# EAGLE design Teensy2ESP8266 (EAGLE 7.5.0)
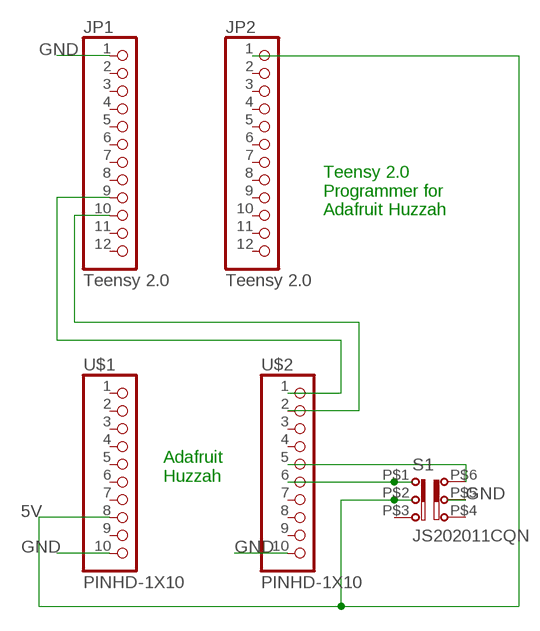
[diagram p0: schematic, sheet 1]

## Parts
JP1  Teensy 2.0  PINHD-1X12  [1X12]
JP2  Teensy 2.0  PINHD-1X12  [1X12]
S1  JS202011CQN  [JS202011CQN]
U$1  PINHD-1X10  [1X10-BIG]
U$2  PINHD-1X10  [1X10-BIG]

## Nets
5V: JP2.1 S1.P$2 U$1.8
GND: JP1.1 S1.P$5 U$1.10 U$2.10
N$1: S1.P$1 U$2.6
N$2: S1.P$6 U$2.5
RX2: JP1.9 U$2.1
TX2: JP1.10 U$2.2
Unconnected: JP1.2 JP1.3 JP1.4 JP1.5 JP1.6 JP1.7 JP1.8 JP1.11 JP1.12 JP2.2 JP2.3 JP2.4 JP2.5 JP2.6 JP2.7 JP2.8 JP2.9 JP2.10 JP2.11 JP2.12 S1.P$3 S1.P$4 U$1.1 U$1.2 U$1.3 U$1.4 U$1.5 U$1.6 U$1.7 U$1.9 U$2.3 U$2.4 U$2.7 U$2.8 U$2.9

## Notes on the sheet
- Teensy 2.0
  Programmer for
  Adafruit Huzzah
- Adafruit
  Huzzah

## Library data of the parts
JP1 JP2 = adafruit:PINHD-1X12: PIN HEADER
S1 = switch-ck:JS202011CQN: DPDT SLIDE SWITCH
U$1 U$2 = adafruit:PINHD-1X10: Pin header 1x10 0.1" spacing With round pins

## Board
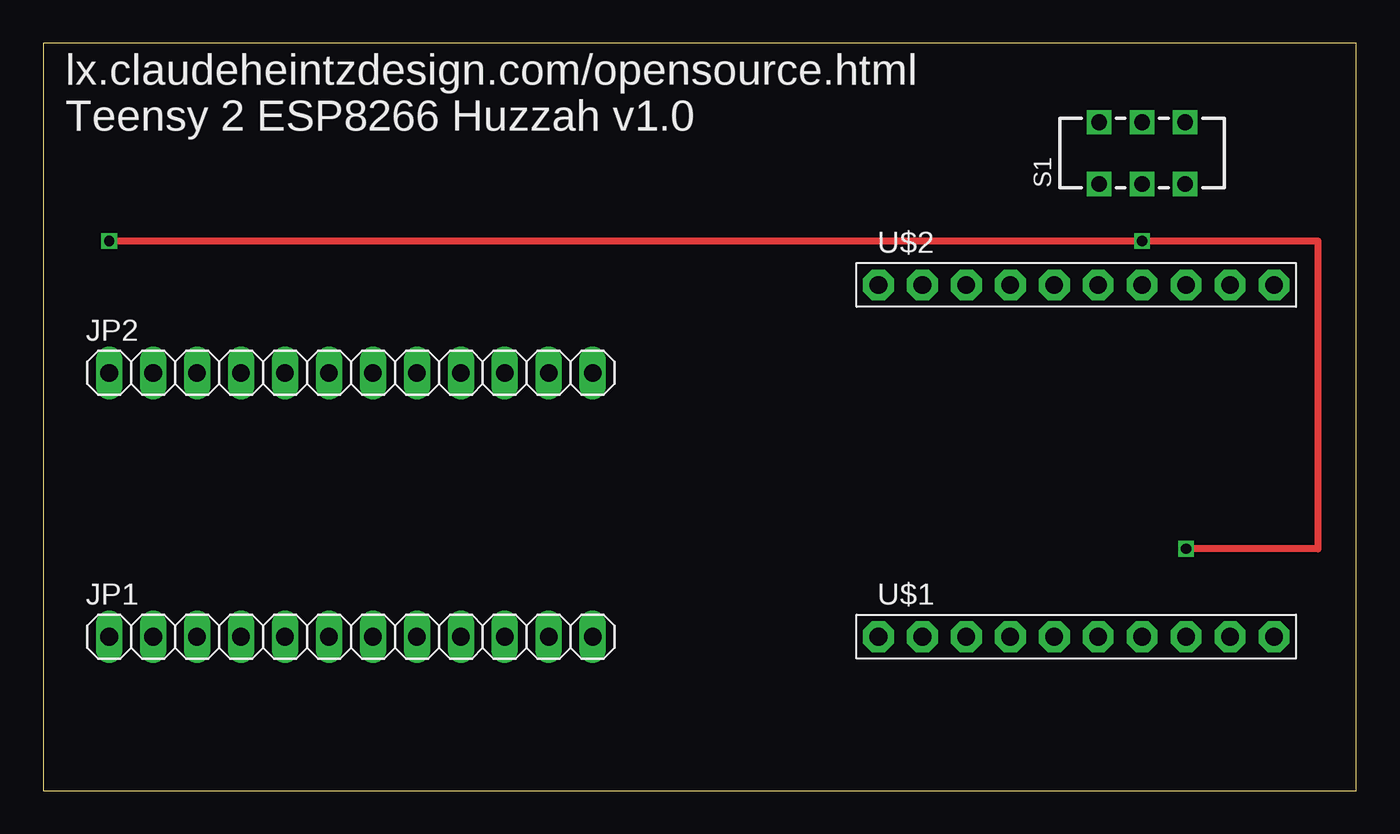
[diagram p1: board, top side]
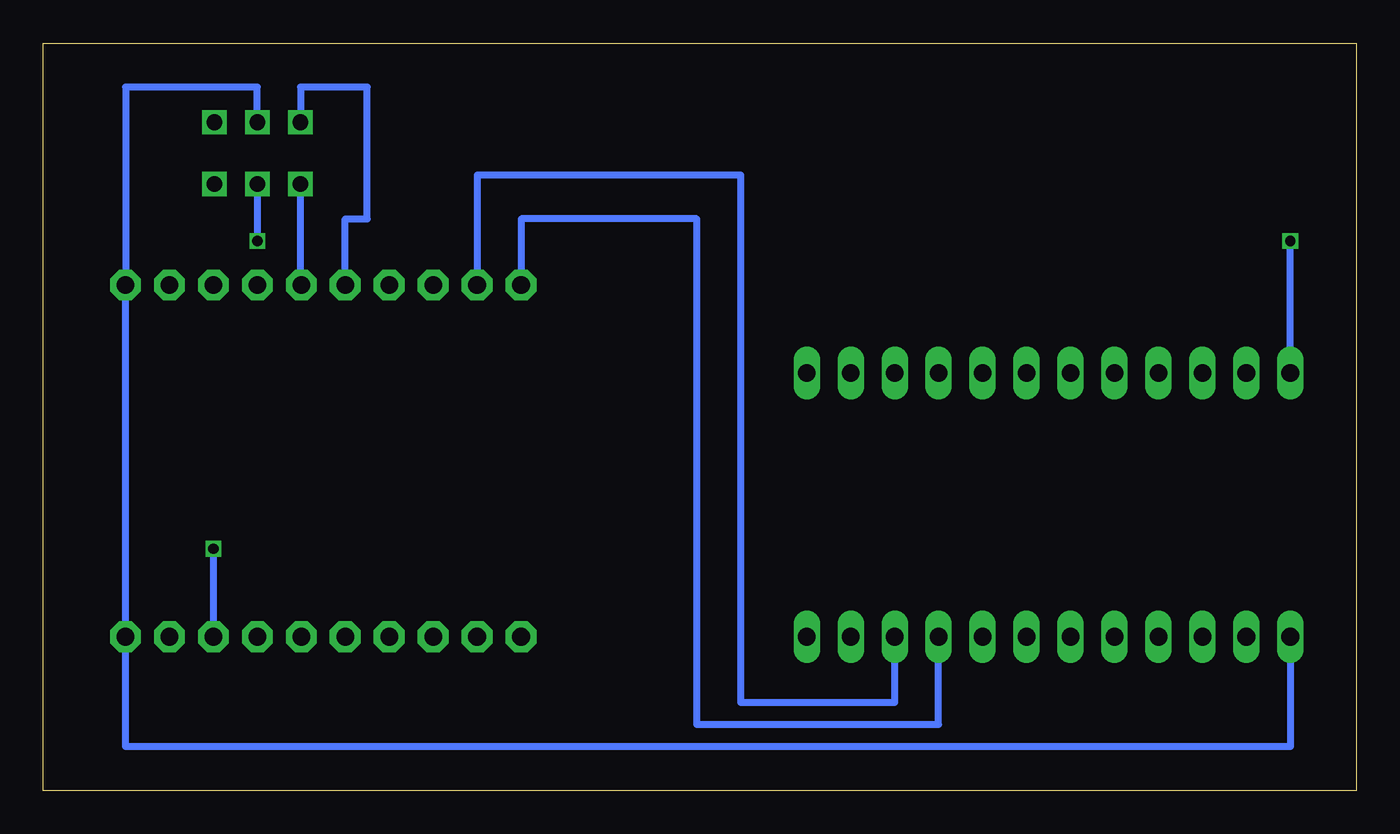
[diagram p2: board, bottom side, seen from below]

Size 75.87 x 43.17 mm. Coordinates in mm from the lower left corner, seen from the top.
Outline: 0,0 75.87,0 75.87,43.17 0,43.17 0,0
Copper layers (1*16): Top 0.035mm / dielectric 1.5mm / Bottom 0.035mm
Design rules "SeeedStudio_2layer_DRU_no_angle_20140221": minimum track width 6mil, minimum drill 12mil, track to track 6mil, track to pad 6mil, pad to pad 6mil, via to via 6mil, smd to smd 0mil, copper to edge 10mil, drill to drill 10mil, minimum pad ring 10mil, minimum via ring 6mil, stop-mask expansion 2mil, vias tented up to drill 100mil, thermal gap 10mil

### Footprints (pad centres in the part's own frame; a part is rotated, then mirrored left to right if it is on the bottom)
1X12 = drill 1.016 long: 1 -13.97,0; 2 -11.43,0; 3 -8.89,0; 4 -6.35,0; 5 -3.81,0; 6 -1.27,0; 7 1.27,0; 8 3.81,0; 9 6.35,0; 10 8.89,0; 11 11.43,0; 12 13.97,0
JS202011CQN = drill 0.9 square: P$1 -2.489,-1.778; P$2 0,-1.778; P$3 2.489,-1.778; P$4 2.489,1.778; P$5 0,1.778; P$6 -2.489,1.778
1X10-BIG = drill 1.016 pad 1.778 octagon: 1 -11.43,0; 2 -8.89,0; 3 -6.35,0; 4 -3.81,0; 5 -1.27,0; 6 1.27,0; 7 3.81,0; 8 6.35,0; 9 8.89,0; 10 11.43,0

### Placement (x,y rotation side)
JP1  17.78,8.89 0 top
JP2  17.78,24.13 0 top
S1  63.5,36.83 0 top
U$1  59.69,8.89 0 top
U$2  59.69,29.21 0 top

### Tracks (layer width: path | path; a pad name or v marks a point on that pad's centre or on a via)
5V  (via drill 0.6)
  Top 0.406: v66.04,13.97 73.66,13.97 73.66,31.75 v63.5,31.75 v3.81,31.75
  Bottom 0.406: S1.P$2 v63.5,31.75 | v66.04,13.97 U$1.8 | JP2.1 v3.81,31.75
GND
  Bottom 0.406: S1.P$5 63.5,40.64 71.12,40.64 U$2.10 U$1.10 71.12,2.54 3.81,2.54 JP1.1
N$1
  Bottom 0.406: U$2.6 61.01,29.21 S1.P$1
N$2
  Bottom 0.406: U$2.5 58.42,33.02 57.15,33.02 57.15,40.64 61.01,40.64 S1.P$6
RX2
  Bottom 0.406: U$2.1 48.26,33.02 38.1,33.02 38.1,3.81 24.13,3.81 JP1.9
TX2
  Bottom 0.406: U$2.2 50.8,35.56 35.56,35.56 35.56,5.08 26.67,5.08 JP1.10

### Text on the board
tNames: lx.claudeheintzdesign.com/opensource.html / Teensy 2 ESP8266 Huzzah v1.0